# Altium schematic sheet servo_board.SchDoc
size A4
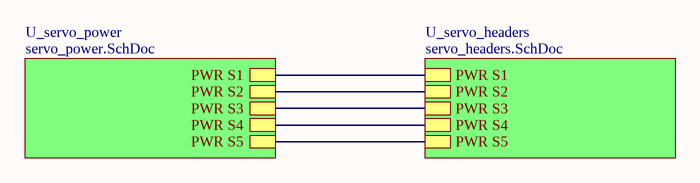
[diagram p0: servo_board.SchDoc]

## Sub-sheets
U_servo_headers = servo_headers.SchDoc: PWR S1, PWR S2, PWR S3, PWR S4, PWR S5
U_servo_power = servo_power.SchDoc: PWR S1, PWR S2, PWR S3, PWR S4, PWR S5

## Nets
(unnamed): sheet U_servo_headers/PWR S1, sheet U_servo_power/PWR S1
(unnamed): sheet U_servo_headers/PWR S2, sheet U_servo_power/PWR S2
(unnamed): sheet U_servo_headers/PWR S3, sheet U_servo_power/PWR S3
(unnamed): sheet U_servo_headers/PWR S4, sheet U_servo_power/PWR S4
(unnamed): sheet U_servo_headers/PWR S5, sheet U_servo_power/PWR S5